# Altium schematic sheet SRAM_Adapter.SchDoc
size A3; Organization: Altium Limited; Address1: L3, 12a Rodborough Rd; Address2: Frenchs Forest; Address3: NSW; Address4: Australia 2086
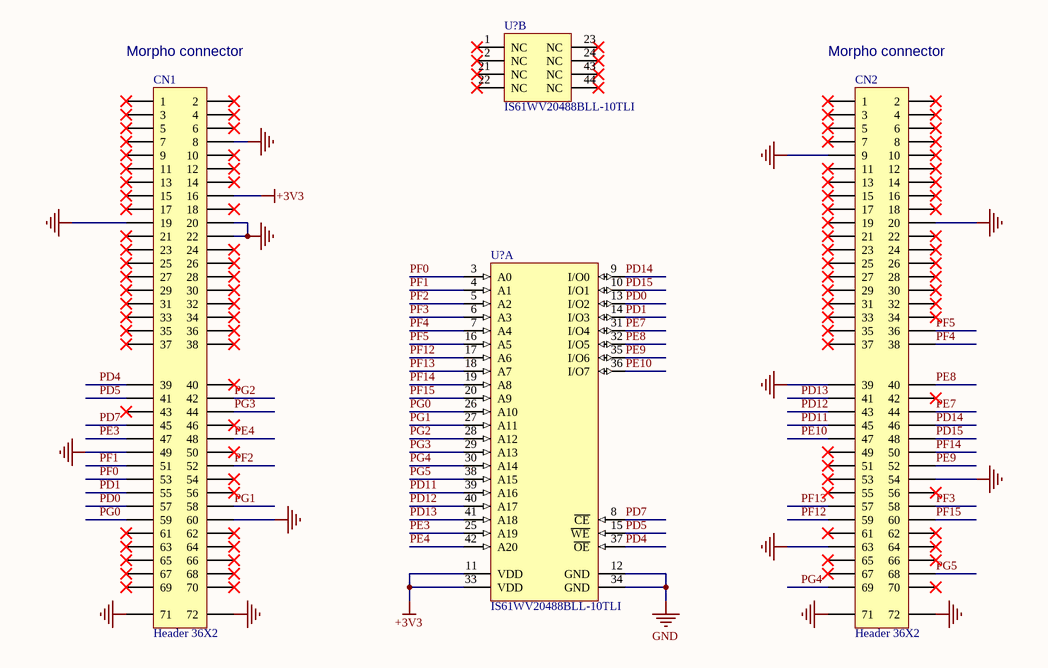
[diagram p0: SRAM_Adapter.SchDoc]

## Parts
(Parts that share a designator on the sheet are numbered #1, #2 ... from top to bottom, then left to right.)
CN1  Header 36X2  [HDR_2x36_2R54_V_M]
CN2  Header 36X2  [HDR_2x36_2R54_V_M]
U?#1  IS61WV20488BLL-10TLI  [ISSI-TSOP-2-44_N]  (part B of 2)
U?#2  IS61WV20488BLL-10TLI  [ISSI-TSOP-2-44_N]  (part A of 2)

## Nets
+3V3: CN1.16 U?#2.11(VDD) U?#2.33(VDD)
GND: CN1.8 CN1.19 CN1.20 CN1.22 CN1.49 CN1.60 CN1.71 CN1.72 CN2.9 CN2.20 CN2.39 CN2.54 CN2.63 CN2.71 CN2.72 U?#2.12(GND) U?#2.34(GND)
PD0: CN1.57 U?#2.13(I/O2)
PD1: CN1.55 U?#2.14(I/O3)
PD4: CN1.39 U?#2.37(~{OE})
PD5: CN1.41 U?#2.15(~{WE})
PD7: CN1.45 U?#2.8(~{CE})
PD11: CN2.45 U?#2.39(A16)
PD12: CN2.43 U?#2.40(A17)
PD13: CN2.41 U?#2.41(A18)
PD14: CN2.46 U?#2.9(I/O0)
PD15: CN2.48 U?#2.10(I/O1)
PE3: CN1.47 U?#2.25(A19)
PE4: CN1.48 U?#2.42(A20)
PE7: CN2.44 U?#2.31(I/O4)
PE8: CN2.40 U?#2.32(I/O5)
PE9: CN2.52 U?#2.35(I/O6)
PE10: CN2.47 U?#2.36(I/O7)
PF0: CN1.53 U?#2.3(A0)
PF1: CN1.51 U?#2.4(A1)
PF2: CN1.52 U?#2.5(A2)
PF3: CN2.58 U?#2.6(A3)
PF4: CN2.38 U?#2.7(A4)
PF5: CN2.36 U?#2.16(A5)
PF12: CN2.59 U?#2.17(A6)
PF13: CN2.57 U?#2.18(A7)
PF14: CN2.50 U?#2.19(A8)
PF15: CN2.60 U?#2.20(A9)
PG0: CN1.59 U?#2.26(A10)
PG1: CN1.58 U?#2.27(A11)
PG2: CN1.42 U?#2.28(A12)
PG3: CN1.44 U?#2.29(A13)
PG4: CN2.69 U?#2.30(A14)
PG5: CN2.68 U?#2.38(A15)

Not connected (* = marked no-connect by the designer): CN1 1* 2* 3* 4* 5* 6* 7* 9* 10* 11* 12* 13* 14* 15* 17* 18* 21* 23* 24* 25* 26* 27* 28* 29* 30* 31* 32* 33* 34* 35* 36* 37* 38* 40* 43* 46* 50* 54* 56* 61* 62* 63* 64* 65* 66* 67* 68* 69* 70*; CN2 1* 2* 3* 4* 5* 6* 7* 8* 10* 11* 12* 13* 14* 15* 16* 17* 18* 19* 21* 22* 23* 24* 25* 26* 27* 28* 29* 30* 31* 32* 33* 34* 35* 37* 42* 49* 51* 53* 55* 56* 61* 62* 64* 65* 66* 67* 70*; U?#1 1(NC)* 2(NC)* 21(NC)* 22(NC)* 23(NC)* 24(NC)* 43(NC)* 44(NC)*

## Notes on the sheet
- (near CN1) Morpho connector
- (near CN2) Morpho connector
- Title
- Size:
- Date:
- A3
- Number:
- Time:
- Revision:
- Sheet
- of
- File:

## Library data of the parts
CN1 CN2 = Header 36X2: Header, 36-Pin, Dual row; System: Connector; Revision: 17-Jul-2002: Re-released for DXP Platform.; Publisher: Altium Limited
U?#1 U?#2 = CMP-0513-00283-1: 16 M High Speed CMOS SRAM, 2 M x 8, -40 to 85 degC, 44-Pin SOP (TSOP-2-44), Pb-Free; Manufacturer: Integrated Silicon Solution Inc (ISSI); Packing: Tray / Tube; Organization: 2M x 8; Speed (ns): 10; PackageVersion: Rev. F, 06/2008; ComponentLink2URL: http://www.issi.com/WW/pdf/61-64WV20488.pdf; ComponentLink3Description: Package Specification; PackageReference: TSOP-2-44; ComponentLink2Description: Datasheet; PartNumber: IS61WV20488BLL-10TLI; ComponentLink1URL: http://www.issi.com/US/index.shtml; ComponentLink3URL: http://www.issi.com/WW/pdf/61-64WV6416EEBLL.pdf; PackageDescription: 44-Pin 400 mil TSOP-2, Body 18.41 x 10.16 mm, Pitch 0.8 mm; ComponentLink1Description: Manufacturer URL; Mounting Technology: Surface Mount; RoHS: Pb-Free; DatasheetVersion: Rev. B